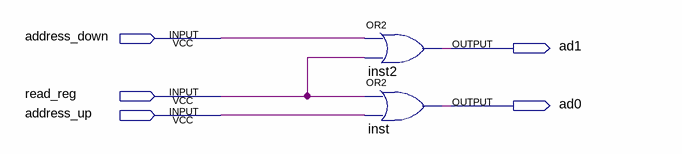
[diagram p0: schematic sheet]
// Quartus schematic codec_mux.bdf as structural Verilog: 2 symbols, 5 pins
module codec_mux (
  input  address_down,
  input  read_reg,
  input  address_up,
  output ad1,
  output ad0
);

  or inst2 (ad1, address_down, read_reg);
  or inst (ad0, read_reg, address_up);
endmodule
